# EAGLE design converter (EAGLE 7.2.0)
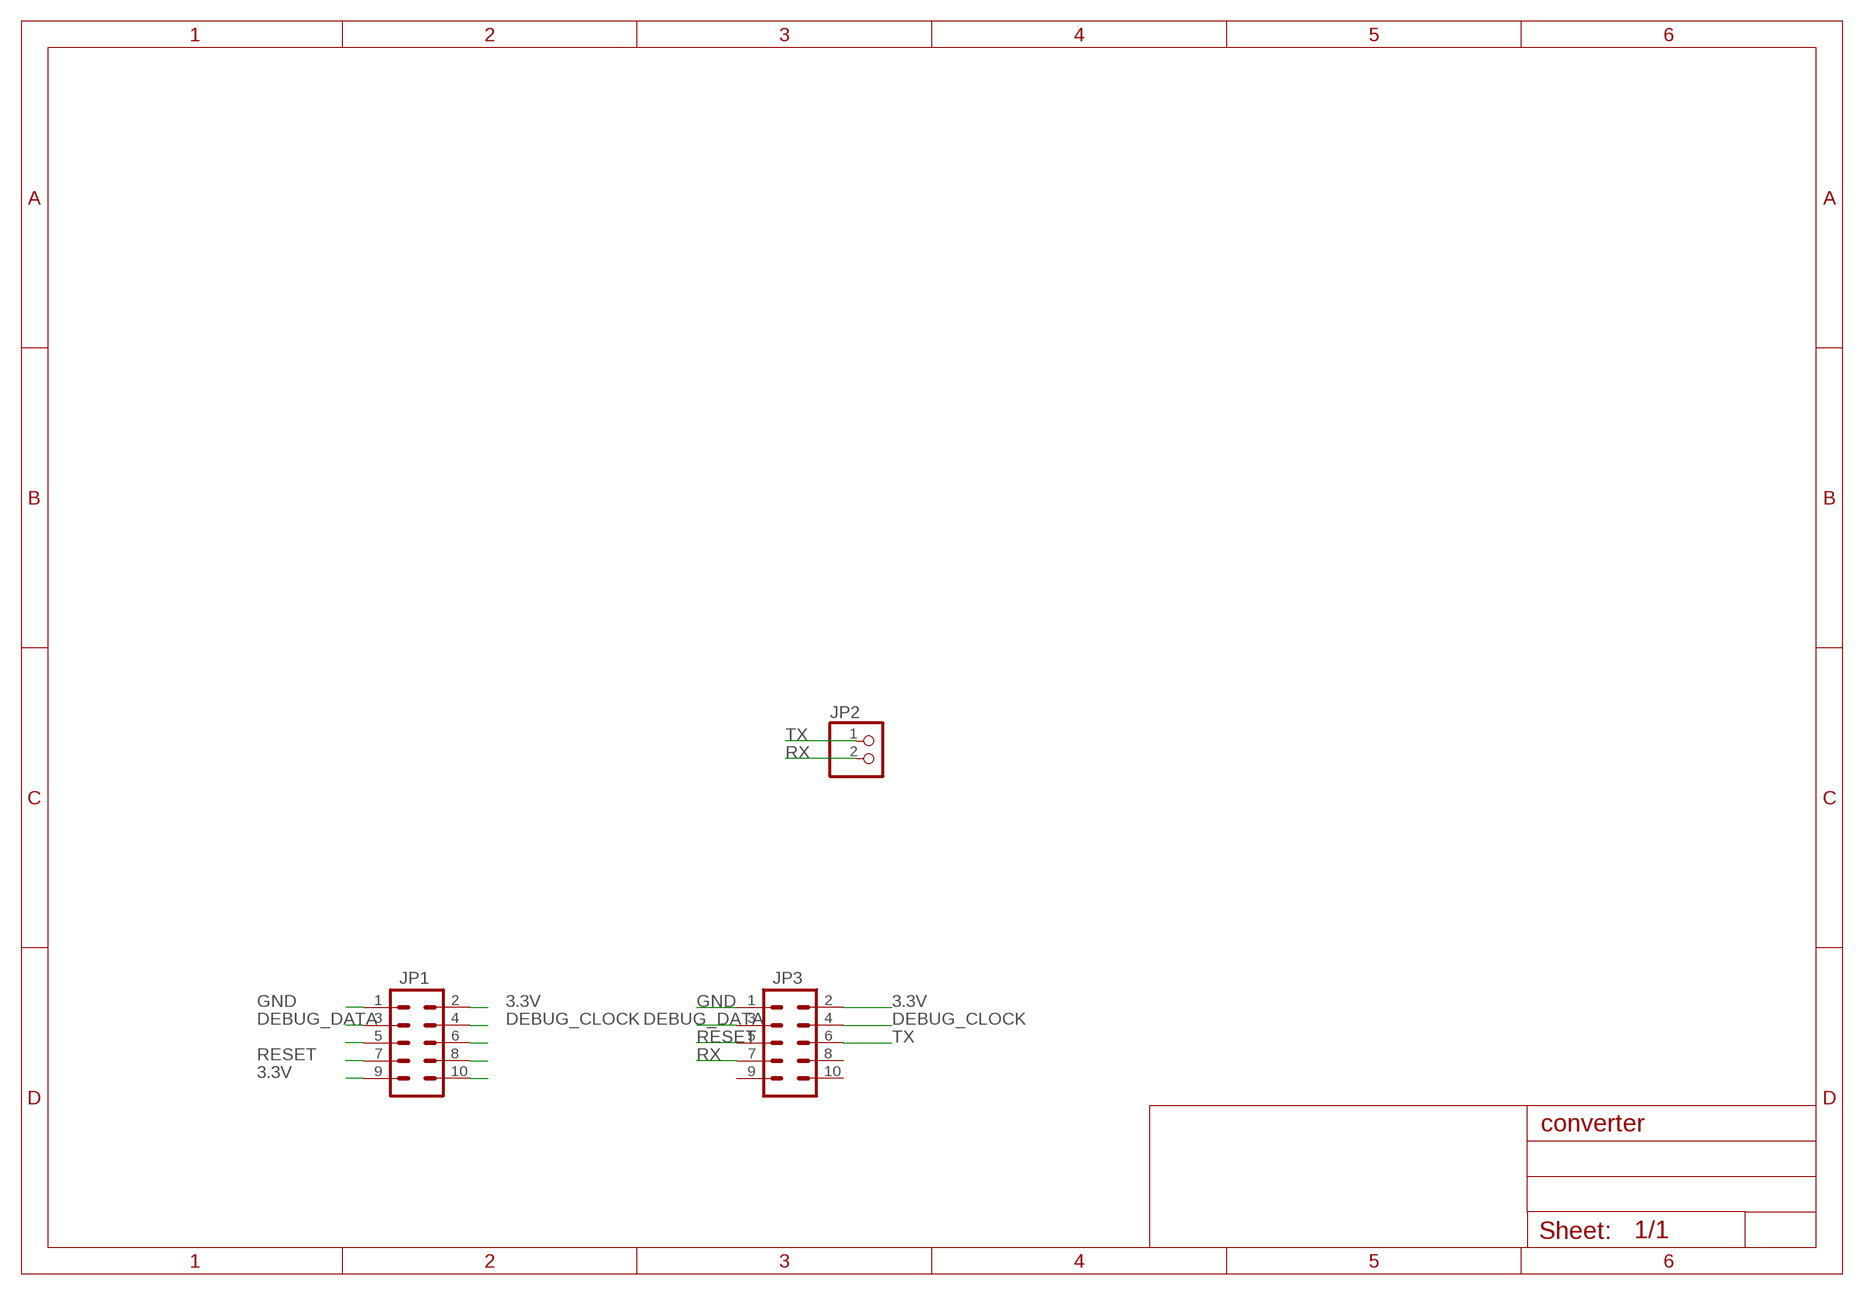
[diagram p0: schematic, sheet 1]

## Parts
JP1  M05X2SHD  [2X5-SHROUDED]
JP2  PINHD-1X2  [1X02]
JP3  M05X2SHD  [2X5-SHROUDED]

## Nets
3.3V: JP1.2 JP1.9 JP3.2
CSN: JP1.5
DEBUG_CLOCK: JP1.4 JP3.4
DEBUG_DATA: JP1.3 JP3.3
GND: JP1.1 JP3.1
MISO: JP1.10
MOSI: JP1.8
RESET: JP1.7 JP3.5
RX: JP2.2 JP3.7
SCLK: JP1.6
TX: JP2.1 JP3.6
Unconnected: JP3.8 JP3.9 JP3.10

## Library data of the parts
JP1 JP3 = SparkFun-Connectors:M05X2: Header 5x2 Standard 10-pin dual row 0.1" header. Commonly used with AVR-ISP. Use with Spark Fun Electronics SKU: PRT-00778
JP2 = pinhead:PINHD-1X2: PIN HEADER

## Board
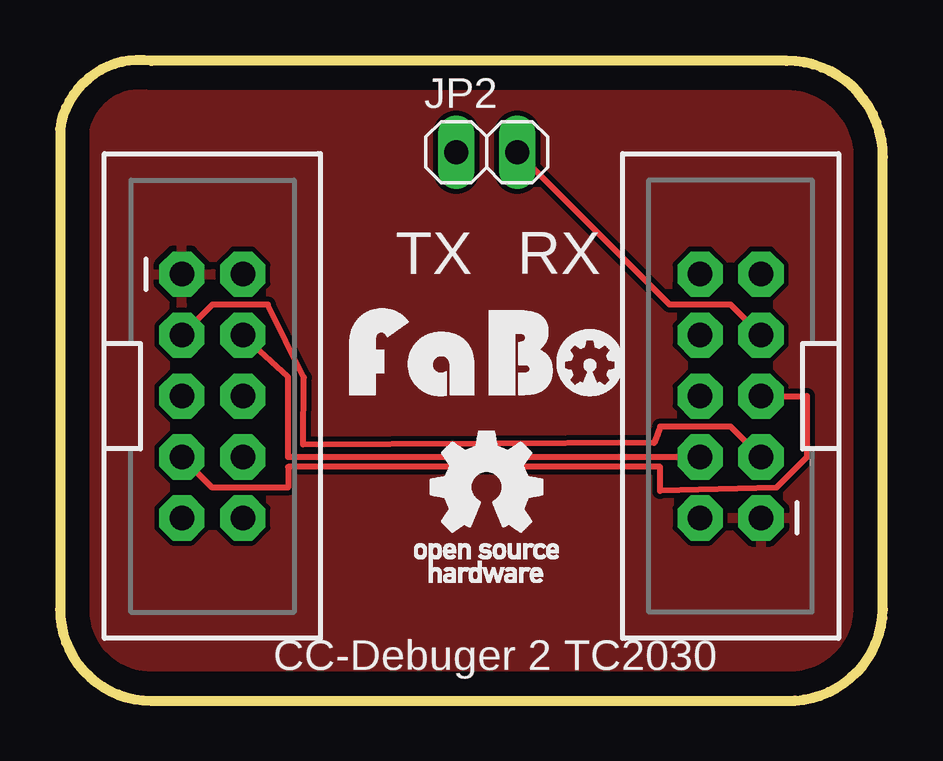
[diagram p1: board, top side]
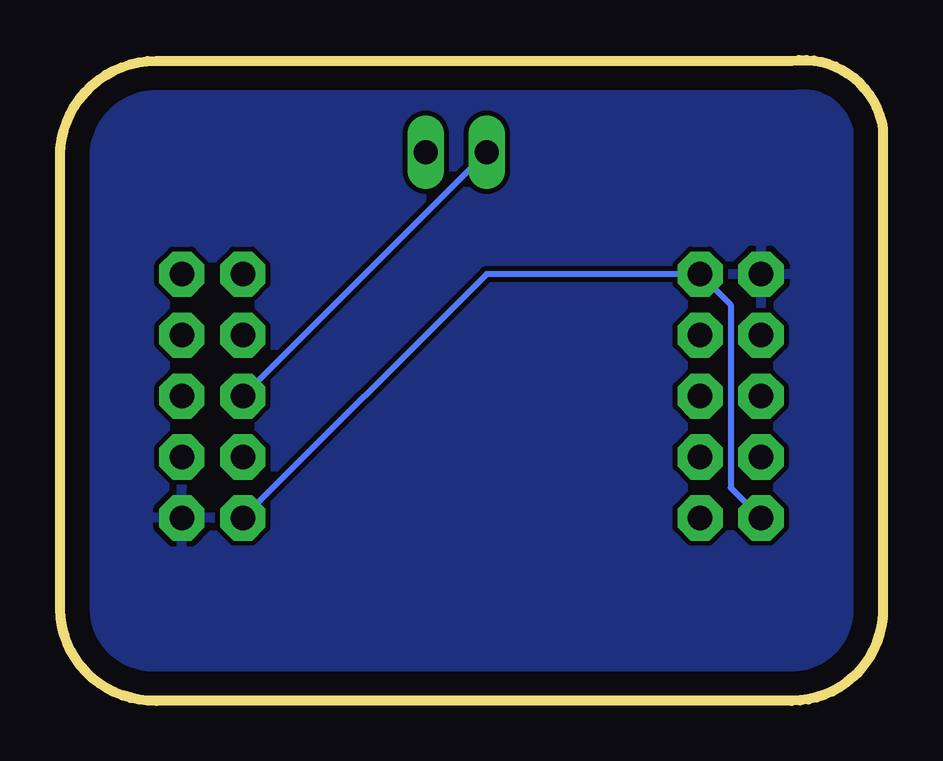
[diagram p2: board, bottom side, seen from below]

Size 34.29 x 26.7 mm. Coordinates in mm from the lower left corner, seen from the top.
Outline: 30.27,26.67 3.81,26.67 arc90 0,23.83 0,3.81 arc90 3.81,0 30.27,0 arc90 34.29,3.81 34.29,22.65 arc90 30.27,26.67
Copper layers (1*16): Top 0.035mm / dielectric 1.5mm / Bottom 0.035mm
Design rules "default": minimum track width 10mil, minimum drill 24mil, track to track 8mil, track to pad 8mil, pad to pad 8mil, via to via 8mil, smd to smd 8mil, copper to edge 40mil, drill to drill 8mil, minimum pad ring 10mil, minimum via ring 8mil, stop-mask expansion 4mil, vias tented up to drill 0mil, thermal gap 10mil

### Footprints (pad centres in the part's own frame; a part is rotated, then mirrored left to right if it is on the bottom)
2X5-SHROUDED = drill 1.016 pad 1.88 octagon: 1 -1.27,5.08; 2 1.27,5.08; 3 -1.27,2.54; 4 1.27,2.54; 5 -1.27,0; 6 1.27,0; 7 -1.27,-2.54; 8 1.27,-2.54; 9 -1.27,-5.08; 10 1.27,-5.08
1X02 = drill 1.016 long: 1 -1.27,0; 2 1.27,0

### Placement (x,y rotation side)
JP1  6.35,12.7 0 top
JP2  17.78,22.86 0 top
JP3  27.94,12.7 180 top
U$1  [LOGO_FABO_M]  17.78,12.7 0 top
U$2  [LOGO_OSHW_T_M]  17.78,8.89 0 top

### Tracks (layer width: path | path; a pad name or v marks a point on that pad's centre or on a via)
3.3V
  Bottom 0.254: JP1.9 6.35,8.89 6.35,16.51 JP1.2 16.51,17.78 JP3.2
DEBUG_CLOCK
  Top 0.254: JP1.4 9.5,13.5 9.5,10.16 JP3.4
DEBUG_DATA
  Top 0.254: JP1.3 6.35,16.51 8.66,16.51 10.16,13.47 10.13,10.68 24.75,10.75 25,11.43 27.94,11.43 JP3.3
GND
  pour Bottom: 0,0 34.29,0 34.29,27.94 0,27.94
  pour Top: 0,0 34.29,0 34.29,27.94 0,27.94
RESET
  Top 0.254: JP1.7 6.35,8.89 9.5,8.89 9.5,9.75 25,9.75 25,8.75 29.84,8.89 31.11,10.16 31.11,12.7 JP3.5
RX
  Top 0.254: JP2.2 25.4,16.51 27.94,16.51 JP3.7
TX
  Bottom 0.254: JP3.6 JP2.1

### Text on the board
tPlace: TX | RX | CC-Debuger 2 TC2030